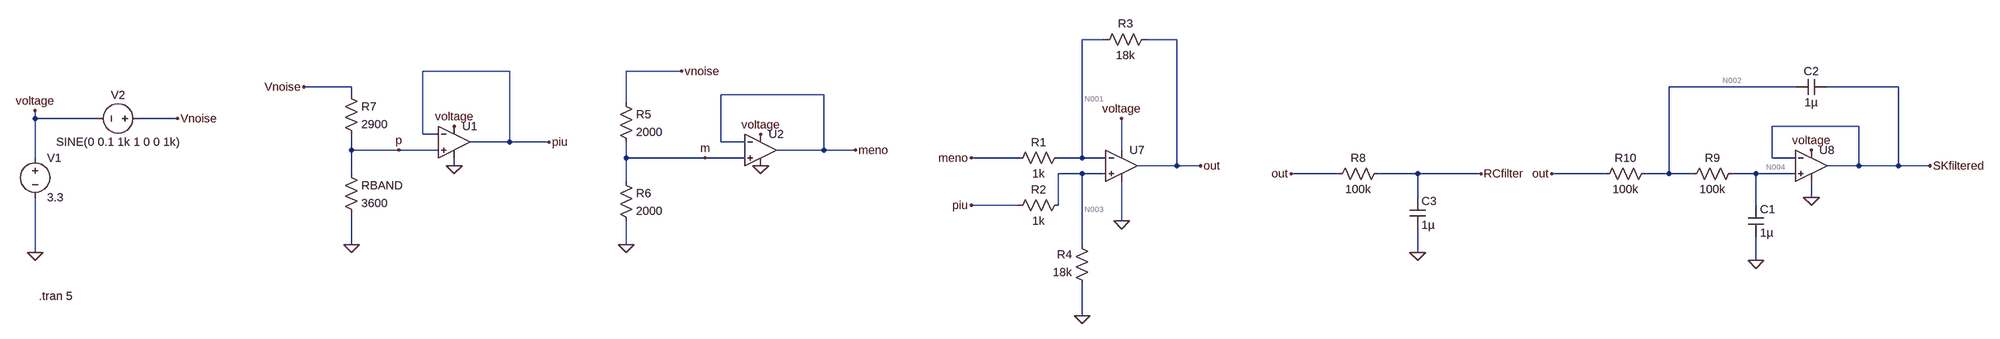
[diagram p0: schematic Sim_condizionamento_hs.asc]
Sim_condizionamento_hs.asc, the LTspice schematic file:
Version 4
SHEET 1 1220 680
WIRE -688 -16 -736 -16
WIRE -544 -16 -608 -16
WIRE -2016 48 -2192 48
WIRE -1568 48 -1680 48
WIRE -2336 80 -2432 80
WIRE 816 80 560 80
WIRE 1024 80 880 80
WIRE -2336 96 -2336 80
WIRE -1280 96 -1488 96
WIRE -1680 112 -1680 48
WIRE -2976 144 -2976 128
WIRE -2848 144 -2976 144
WIRE -2688 144 -2768 144
WIRE 944 160 768 160
WIRE -2192 176 -2192 48
WIRE -2160 176 -2192 176
WIRE -2016 192 -2016 48
WIRE -2016 192 -2096 192
WIRE -1936 192 -2016 192
WIRE -1488 192 -1488 96
WIRE -1440 192 -1488 192
WIRE -2336 208 -2336 176
WIRE -2240 208 -2336 208
WIRE -2160 208 -2240 208
WIRE -1280 208 -1280 96
WIRE -1280 208 -1376 208
WIRE -1216 208 -1280 208
WIRE -656 208 -656 144
WIRE -2976 224 -2976 144
WIRE -1680 224 -1680 192
WIRE -1520 224 -1680 224
WIRE -1440 224 -1520 224
WIRE -864 224 -960 224
WIRE -736 224 -736 -16
WIRE -736 224 -784 224
WIRE -688 224 -736 224
WIRE 768 224 768 160
WIRE 816 224 768 224
WIRE -2128 240 -2128 224
WIRE -544 240 -544 -16
WIRE -544 240 -624 240
WIRE -496 240 -544 240
WIRE 944 240 944 160
WIRE 944 240 880 240
WIRE 1024 240 1024 80
WIRE 1024 240 944 240
WIRE 1088 240 1024 240
WIRE -2336 256 -2336 208
WIRE -736 256 -784 256
WIRE -688 256 -736 256
WIRE -112 256 -208 256
WIRE 48 256 -32 256
WIRE 176 256 48 256
WIRE 432 256 320 256
WIRE 560 256 560 80
WIRE 560 256 512 256
WIRE 608 256 560 256
WIRE 736 256 688 256
WIRE 816 256 736 256
WIRE -1680 272 -1680 224
WIRE 48 304 48 256
WIRE 848 304 848 272
WIRE -864 320 -960 320
WIRE -784 320 -784 256
WIRE 736 320 736 256
WIRE -656 352 -656 272
WIRE -2336 400 -2336 336
WIRE -1680 400 -1680 352
WIRE -736 400 -736 256
WIRE -2976 416 -2976 304
WIRE 48 416 48 368
WIRE 736 432 736 384
WIRE -736 544 -736 480
FLAG -2976 416 0
FLAG -496 240 out
FLAG -736 544 0
FLAG -656 352 0
FLAG -2976 128 voltage
FLAG -656 144 voltage
FLAG -1680 400 0
FLAG -1568 48 vnoise
FLAG -2432 80 Vnoise
FLAG -960 320 piu
FLAG -960 224 meno
FLAG -2336 400 0
FLAG -2240 208 p
FLAG -1520 224 m
FLAG 848 304 0
FLAG 736 432 0
FLAG 1088 240 SKfiltered
FLAG 848 208 voltage
FLAG -2688 144 Vnoise
FLAG -2128 160 voltage
FLAG -1408 176 voltage
FLAG -1408 240 0
FLAG -2128 240 0
FLAG -1936 192 piu
FLAG -1216 208 meno
FLAG 320 256 out
FLAG -208 256 out
FLAG 48 416 0
FLAG 176 256 RCfilter
SYMBOL voltage -2976 208 R0
WINDOW 123 0 0 Left 0
WINDOW 39 0 0 Left 0
SYMATTR InstName V1
SYMATTR Value 3.3
SYMBOL res -768 208 R90
WINDOW 0 0 56 VBottom 2
WINDOW 3 32 56 VTop 2
SYMATTR InstName R1
SYMATTR Value 1k
SYMBOL res -768 304 R90
WINDOW 0 0 56 VBottom 2
WINDOW 3 32 56 VTop 2
SYMATTR InstName R2
SYMATTR Value 1k
SYMBOL res -592 -32 R90
WINDOW 0 -1 56 VBottom 2
WINDOW 3 32 56 VTop 2
SYMATTR InstName R3
SYMATTR Value 18k
SYMBOL res -720 496 R180
WINDOW 0 36 76 Left 2
WINDOW 3 36 40 Left 2
SYMATTR InstName R4
SYMATTR Value 18k
SYMBOL res -1696 96 R0
SYMATTR InstName R5
SYMATTR Value 2000
SYMBOL res -1696 256 R0
SYMATTR InstName R6
SYMATTR Value 2000
SYMBOL res -2352 80 R0
SYMATTR InstName R7
SYMATTR Value 2900
SYMBOL res -2352 240 R0
SYMATTR InstName RBAND
SYMATTR Value 3600
SYMBOL cap 720 320 R0
SYMATTR InstName C1
SYMATTR Value 1µ
SYMBOL cap 880 64 R90
WINDOW 0 0 32 VBottom 2
WINDOW 3 32 32 VTop 2
SYMATTR InstName C2
SYMATTR Value 1µ
SYMBOL res 704 240 R90
WINDOW 0 0 56 VBottom 2
WINDOW 3 32 56 VTop 2
SYMATTR InstName R9
SYMATTR Value 100k
SYMBOL res 528 240 R90
WINDOW 0 0 56 VBottom 2
WINDOW 3 32 56 VTop 2
SYMATTR InstName R10
SYMATTR Value 100k
SYMBOL voltage -2752 144 R90
WINDOW 0 -32 56 VBottom 2
WINDOW 3 32 56 VTop 2
WINDOW 123 0 0 Left 0
WINDOW 39 0 0 Left 0
SYMATTR InstName V2
SYMATTR Value SINE(0 0.1 1k 1 0 0 1k)
SYMBOL OpAmps\\UniversalOpAmp2 -656 240 R0
SYMATTR InstName U7
SYMBOL OpAmps\\UniversalOpAmp2 848 240 R0
SYMATTR InstName U8
SYMBOL OpAmps\\UniversalOpAmp2 -2128 192 R0
SYMATTR InstName U1
SYMBOL OpAmps\\UniversalOpAmp2 -1408 208 R0
SYMATTR InstName U2
SYMBOL res -16 240 R90
WINDOW 0 0 56 VBottom 2
WINDOW 3 32 56 VTop 2
SYMATTR InstName R8
SYMATTR Value 100k
SYMBOL cap 32 304 R0
SYMATTR InstName C3
SYMATTR Value 1µ
TEXT -2968 504 Left 2 !.tran 5

The netlist it stands for:
* Sim_condizionamento_hs.asc
V1 voltage 0 3.3
R1 N001 meno 1k
R2 N003 piu 1k
R3 out N001 18k
R4 0 N003 18k
R5 vnoise m 2000
R6 m 0 2000
R7 vnoise p 2900
RBAND p 0 3600
C1 N004 0 1µ
C2 SKfiltered N002 1µ
R9 N004 N002 100k
R10 N002 out 100k
V2 vnoise voltage SINE(0 0.1 1k 1 0 0 1k)
XU7 N003 N001 voltage 0 out level2 Avol=1Meg GBW=10Meg Slew=10Meg Ilimit=25m Rail=0 Vos=0 En=0 Enk=0 In=0 Ink=0 Rin=500Meg  ; pins In+ In- V+ V- OUT
XU8 N004 SKfiltered voltage 0 SKfiltered level2 Avol=1Meg GBW=10Meg Slew=10Meg Ilimit=25m Rail=0 Vos=0 En=0 Enk=0 In=0 Ink=0 Rin=500Meg  ; pins In+ In- V+ V- OUT
XU1 p piu voltage 0 piu level2 Avol=1Meg GBW=10Meg Slew=10Meg Ilimit=25m Rail=0 Vos=0 En=0 Enk=0 In=0 Ink=0 Rin=500Meg  ; pins In+ In- V+ V- OUT
XU2 m meno voltage 0 meno level2 Avol=1Meg GBW=10Meg Slew=10Meg Ilimit=25m Rail=0 Vos=0 En=0 Enk=0 In=0 Ink=0 Rin=500Meg  ; pins In+ In- V+ V- OUT
R8 RCfilter out 100k
C3 RCfilter 0 1µ
.tran 5
.lib UniversalOpAmp2.lib
.backanno
.end

* Results of the author's LTspice run, read from the files saved beside the schematic
* Operating Point, zero values left out:
*   V(voltage) = 3.3 V
*   V(n001) = 1.731 V
*   V(meno) = 1.65 V
*   V(n003) = 1.731 V
*   V(piu) = 1.828 V
*   V(out) = 3.198 V
*   V(vnoise) = 3.3 V
*   V(m) = 1.65 V
*   V(p) = 1.828 V
*   V(n004) = 3.198 V
*   V(skfiltered) = 3.198 V
*   V(n002) = 3.198 V
*   V(rcfilter) = 3.198 V
*   I(R10) = -3.096 nA
*   I(R9) = -3.096 nA
*   I(Rband) = 507.7 µA
*   I(R7) = 507.7 µA
*   I(R6) = 825 µA
*   I(R5) = 825 µA
*   I(R4) = -96.19 µA
*   I(R3) = 81.5 µA
*   I(R2) = -96.19 µA
*   I(R1) = 81.5 µA
*   I(V2) = -1.333 mA
*   I(V1) = -1.849 mA